# Altium project pca63571.PrjPCB
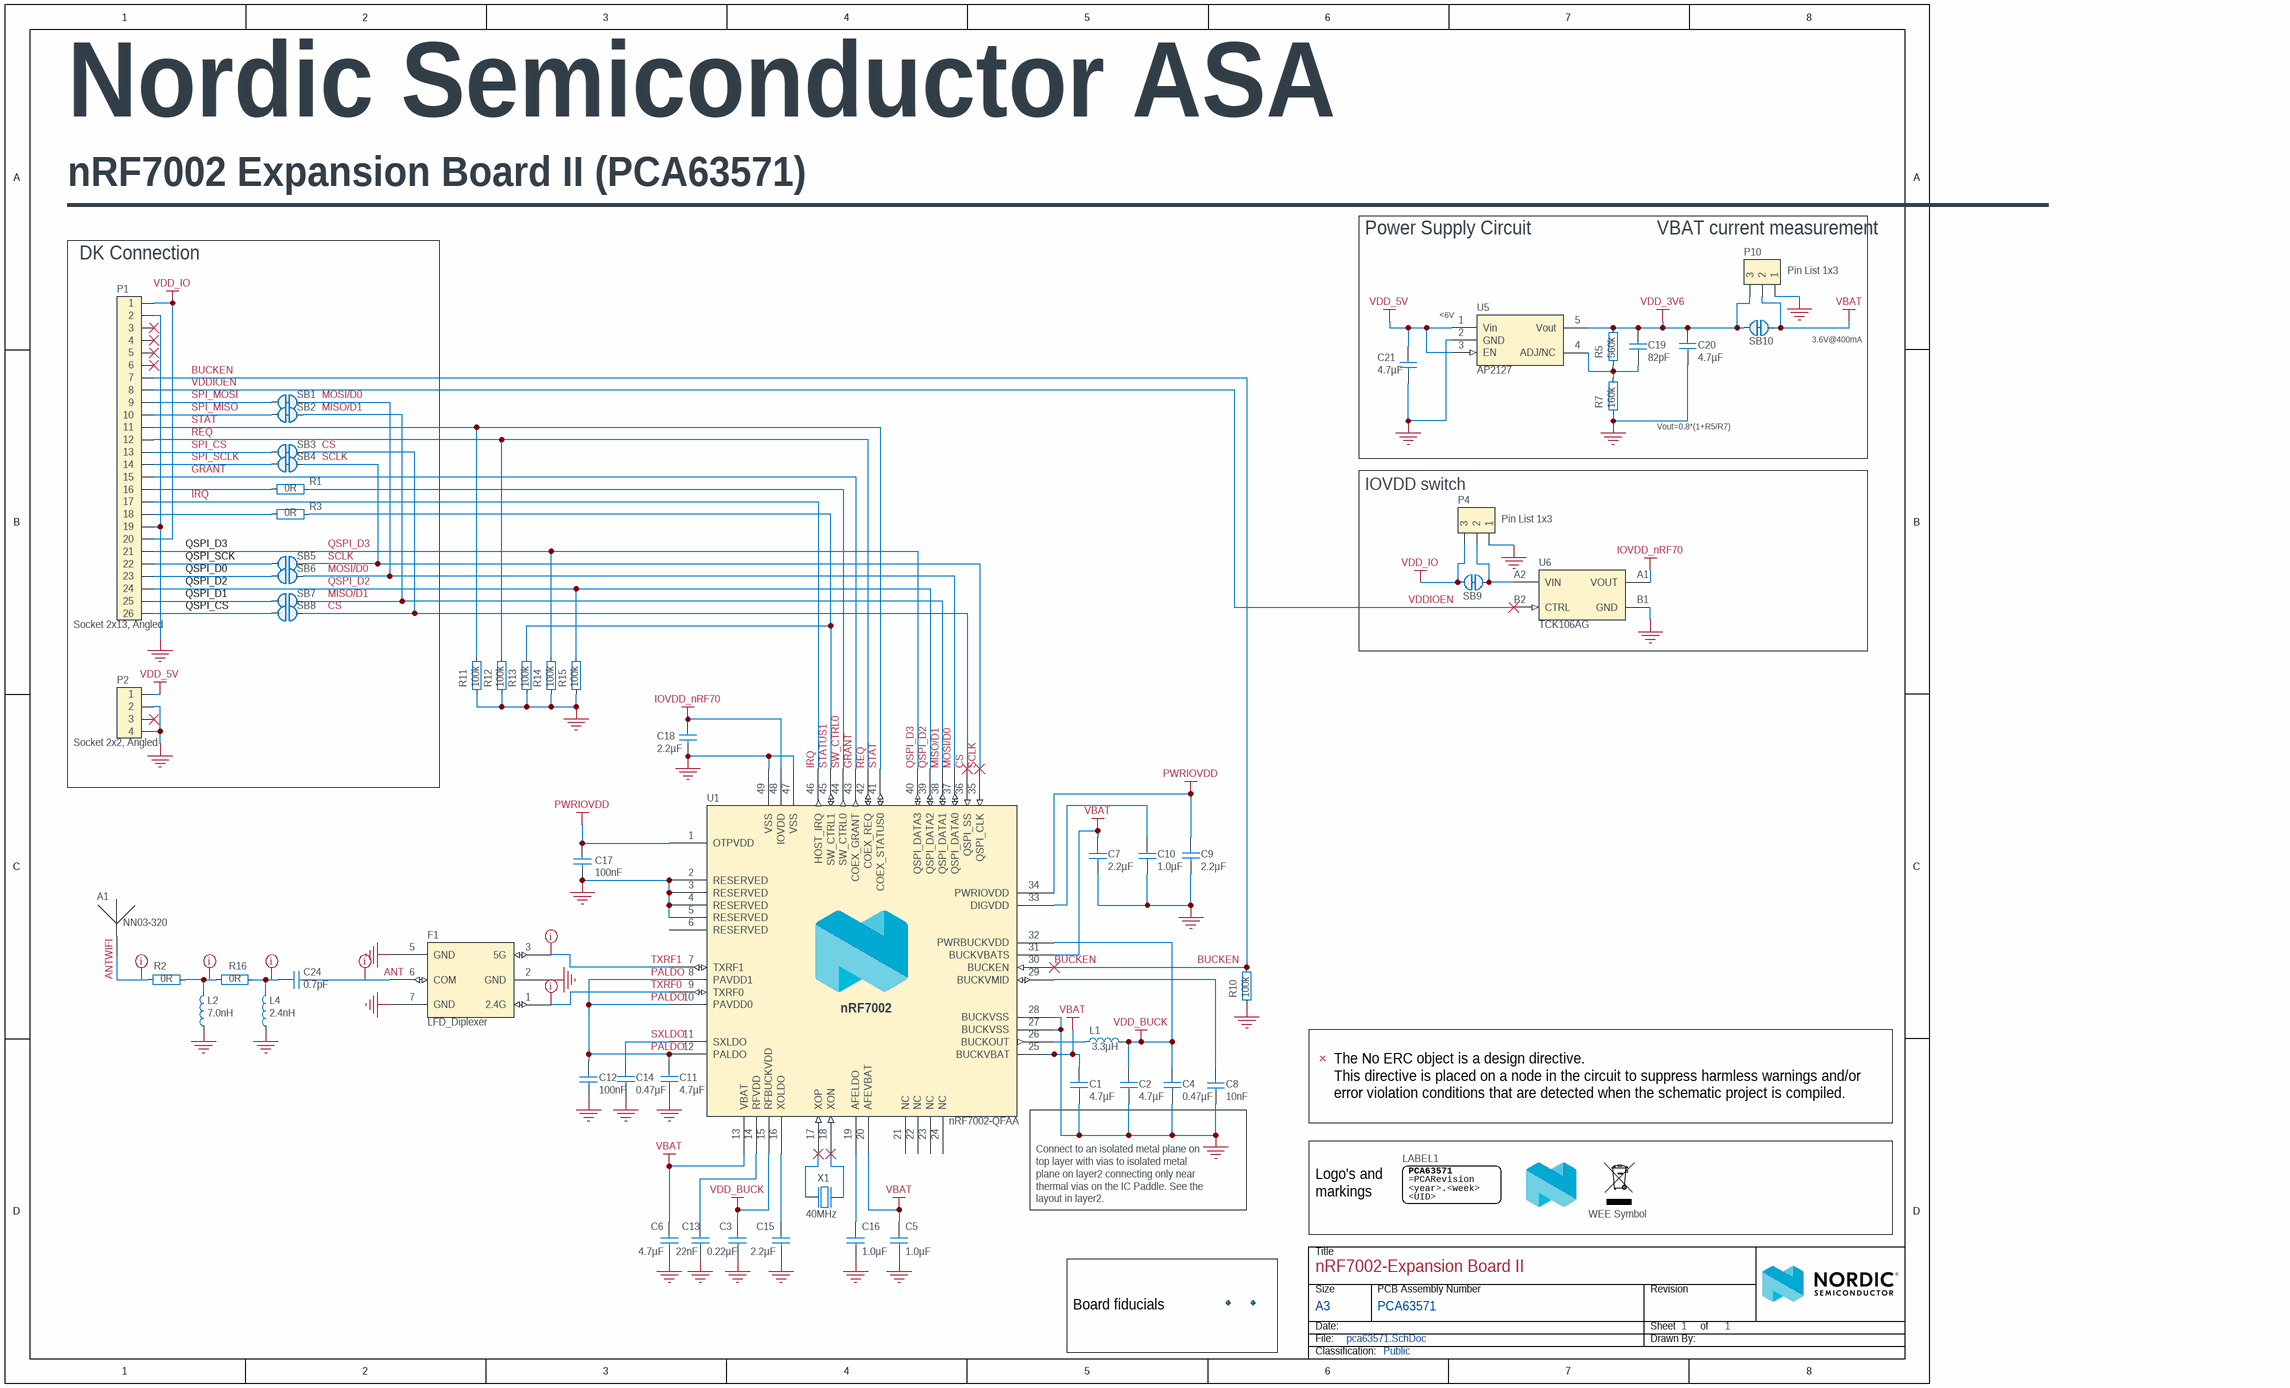
[diagram p0: pca63571.SchDoc]
SurfaceFinish: ENIG Gold; SoldermaskColor: Blue; SilkscreenColor: White; ProjectNumber: 4486; ProjectName: nRF7002 EXpansion Board II; ProductName: nRF7002-EB2; PCBStackup: 4001; PCBRevision: 0071HANY; PCBNumber: 400902; PCARevision: 1.0.0; PCAName: PCA63571; Organization: Nordic Semiconductor; NrOfLayers: 4; Dielectric: FR-4; Designer: HANY; Compliance: RoHS, REACH, Halogen-Free; Classification: Public; BoardTitle: nRF7002 Expansion Board II; BoardThickness: 1.6mm
1 sheet, 62 parts. Net scope: global (net labels, ports and power ports of the same name join across sheets).
Board files: 400902.PcbDoc, 400902_panel.PcbDoc

## Sheet pca63571.SchDoc: nRF7002-Expansion Board II
size A3; Organization: Nordic Semiconductor; Revision: 1.0.0; SheetNumber: 1; SheetTotal: 1; Author: HANY; CompanyName: Nordic Semiconductor; DrawnBy: HANY; DocumentSize: A4; ProjectName: nRF7002 EXpansion Board II

### Parts
A1  NN03-320  [NN03-320]
C1  4.7µF  [CAPC1608X06L]
C2  4.7µF  [CAPC1608X06L]
C3  0.22µF  [CAPC0603X03L_C]
C4  0.47µF  [CAPC0603X03L_C]
C5  1.0µF  [CAPC1005X04L]
C6  4.7µF  [CAPC1608X06L]
C7  2.2µF  [CAPC1608X06L]
C8  10nF  [CAPC0603X03L_C]
C9  2.2µF  [CAPC1005X04L]
C10  1.0µF  [CAPC1005X04L]
C11  4.7µF  [CAPC1608X06L]
C12  100nF  [CAPC0603X03L_C]
C13  22nF  [CAPC0603X03L_C]
C14  0.47µF  [CAPC0603X03L_C]
C15  2.2µF  [CAPC0603X03L_C]
C16  1.0µF  [CAPC1005X04L]
C17  100nF  [CAPC0603X03L_C]
C18  2.2µF  [CAPC1608X06L]
C19  82pF  [CAPC0603X03L_C]
C20  4.7µF  [CAPC1608X06L]
C21  4.7µF  [CAPC1608X06L]
C24  0.7pF  [CAPC1005X04L]
F1  LFD_Diplexer  [CAF-50P160X80-6N]
Fid1  Fiducial mark  [Fiducial]  (value not drawn)  (no BOM)
Fid2  Fiducial mark  [Fiducial]  (value not drawn)  (no BOM)
L1  3.3µH  [INDC2520X10N]
L2  7.0nH  [INDC1005X04L_WW]
L4  2.4nH  [INDC1005X04L_WW]
LABEL1  12x32mm  [LabelSilk_12x32]  (value not drawn)
LOGO1  (no value)  [NORDIC_LOGO_LYING]  (graphical)
LOGO2  WEE Symbol  [WEEE_3x4.5mm]  (no BOM)
P1  Socket 2x13, Angled  [SOCKET_ANG_2x13_SMD-2.54mm-Mirrored]
P2  Socket 2x2, Angled  [SOCKET_ANG_2x2_SMD-2.54mm-Mirrored]
P4  Pin List 1x3  [LIST_1x3]
P10  Pin List 1x3  [LIST_1x3]
R1  0R  [RESC1005X04L]
R2  0R  [RESC1005X04L]
R3  0R  [RESC1005X04L]
R5  560k  [RESC0603X03L_C]
R7  160k  [RESC0603X03L_C]
R10  100k  [RESC0603X03L_C]
R11  100k  [RESC0603X03L_C]
R12  100k  [RESC0603X03L_C]
R13  100k  [RESC0603X03L_C]
R14  100k  [RESC0603X03L_C]
R15  100k  [RESC0603X03L_C]
R16  0R  [RESC1005X04L]
SB1  Solderbridge  [Solderbridge_SHORTED_0.4]  (value not drawn)  (net tie, no BOM)
SB2  Solderbridge  [Solderbridge_SHORTED_0.4]  (value not drawn)  (net tie, no BOM)
SB3  Solderbridge  [Solderbridge_SHORTED_0.4]  (value not drawn)  (net tie, no BOM)
SB4  Solderbridge  [Solderbridge_SHORTED_0.4]  (value not drawn)  (net tie, no BOM)
SB5  Solderbridge  [Solderbridge_0.4]  (value not drawn)  (no BOM)
SB6  Solderbridge  [Solderbridge_0.4]  (value not drawn)  (no BOM)
SB7  Solderbridge  [Solderbridge_0.4]  (value not drawn)  (no BOM)
SB8  Solderbridge  [Solderbridge_0.4]  (value not drawn)  (no BOM)
SB9  Solderbridge  [Solderbridge_Shorted_Power]  (value not drawn)  (net tie, no BOM)
SB10  Solderbridge  [Solderbridge_Shorted_Power]  (value not drawn)  (net tie, no BOM)
U1  nRF7002-QFAA  [QFN40P600X600X60-48N]
U5  AP2127  [SOT95P282X145-5N]
U6  TCK106AG  [BGA4C40P2X2_76X76X62]
X1  40MHz  [BT-XTAL_1612]

### Blocks framed on the sheet
DK Connection: P1 P2 R1 R3 SB1-SB8
IOVDD switch: P4 SB9 U6

### Nets
GND: C1.1 C2.1 C3.1 C4.1 C5.1 C6.1 C7.2 C8.2 C9.1 C10.2 C11.1 C12.2 C13.1 C14.1 C15.1 C16.1 C17.1 C18.1 C20.1 C21.1 F1.2(GND) F1.5(GND) F1.7(GND) L2.1 L4.1 P1.2 P1.19 P2.2 P2.4 P4.1 P10.1 R7.1 R10.2 R11.2 R12.2 R13.1 R14.2 R15.2 U1.2(RESERVED) U1.3(RESERVED) U1.4(RESERVED) U1.5(RESERVED) U1.27(BUCKVSS) U1.28(BUCKVSS) U1.47(VSS) U1.49(VSS) U5.2(GND) U6.B1(GND) X1.2(GND) X1.4(GND)
IOVDD_nRF70: C18.2 U1.48(IOVDD) U6.A1(VOUT)
PWRIOVDD: C9.2 C17.2 U1.1(OTPVDD) U1.34(PWRIOVDD)
VBAT: C1.2 C5.2 C6.2 C7.1 P10.2 SB10.2 U1.13(VBAT) U1.20(AFEVBAT) U1.25(BUCKVBAT) U1.31(BUCKVBATS)
VDD_3V6: C19.1 C20.2 P10.3 R5.2 SB10.1 U5.5(Vout)
VDD_5V: C21.2 P2.1 U5.1(Vin) U5.3(EN)
VDD_BUCK: C2.2 C3.2 C4.2 L1.2 U1.15(RFBUCKVDD) U1.32(PWRBUCKVDD)
VDD_IO: P1.1 P1.20 P4.3 SB9.2
ANT: C24.2 F1.6(COM)
ANTWIFI: A1.4(Feed1) R2.1
BUCKEN: P1.7 R10.1 U1.30(BUCKEN)
CS: SB3.1 SB8.1 U1.36(QSPI_SS)
GRANT: P1.15 U1.43(COEX_GRANT)
IRQ: P1.17 U1.46(HOST_IRQ)
MISO/D1: SB2.1 SB7.1 U1.38(QSPI_DATA1)
MOSI/D0: SB1.1 SB6.1 U1.37(QSPI_DATA0)
PALDO: C11.2 C12.1 U1.8(PAVDD1) U1.10(PAVDD0) U1.12(PALDO)
QSPI_D2: P1.24 R15.1 U1.39(QSPI_DATA2)
QSPI_D3: P1.21 R14.1 U1.40(QSPI_DATA3)
REQ: P1.12 R12.1 U1.42(COEX_REQ)
SCLK: SB4.1 SB5.1 U1.35(QSPI_CLK)
SPI_CS: P1.13 SB3.2
SPI_MISO: P1.10 SB2.2
SPI_MOSI: P1.9 SB1.2
SPI_SCLK: P1.14 SB4.2
STAT: P1.11 R11.1 U1.41(COEX_STATUS0)
STATUS1: R3.2 R13.2 U1.45(SW_CTRL1)
SW_CTRL0: R1.2 U1.44(SW_CTRL0)
SXLDO: C14.2 U1.11(SXLDO)
TXRF0: F1.1(2.4G) U1.9(TXRF0)
TXRF1: F1.3(5G) U1.7(TXRF1)
VDDIOEN: P1.8 U6.B2(CTRL)
NetC8_1: C8.1 U1.29(BUCKVMID)
NetC10_1: C10.1 U1.33(DIGVDD)
NetC13_2: C13.2 U1.14(RFVDD)
NetC15_2: C15.2 U1.16(XOLDO)
NetC16_2: C16.2 U1.19(AFELDO)
NetC19_2: C19.2 R5.1 R7.2 U5.4(ADJ/NC)
NetC24_1: C24.1 L4.2 R16.2
NetL1_1: L1.1 U1.26(BUCKOUT)
NetL2_2: L2.2 R2.2 R16.1
NetP1_16: P1.16 R1.1
NetP1_18: P1.18 R3.1
NetP1_22: P1.22 SB5.2
NetP1_23: P1.23 SB6.2
NetP1_25: P1.25 SB7.2
NetP1_26: P1.26 SB8.2
NetP4_2: P4.2 SB9.1 U6.A2(VIN)
NetU1_17: U1.17(XOP) X1.1(inp)
NetU1_18: U1.18(XON) X1.3(out)

Not connected (* = marked no-connect by the designer): A1 1(NC) 2(GND) 3(Feed2); P1 3* 4* 5* 6*; P2 3*; U1 6(RESERVED) 21(NC) 22(NC) 23(NC) 24(NC)

### Layout directives
net class RF: ANT, ANTWIFI, NetC24_1, NetL2_2, TXRF0, TXRF1

### Notes on the sheet
- Nordic Semiconductor ASA
- nRF7002 Expansion Board II (PCA63571)
- _______________________________________________________________________
- Power Supply Circuit
- (near P10) VBAT current measurement
- (near U5) <6V
- 3.6V@400mA
- Vout=0.8*(1+R5/R7)
- QSPI_D2
- QSPI_D3
- QSPI_SCK
- QSPI_D0
- QSPI_D1
- QSPI_CS
- The No ERC object is a design directive.
  This directive is placed on a node in the circuit to suppress harmless warnings and/or error violation conditions that are detected when the schematic project is compiled.
- (near U1) Connect to an isolated metal plane on top layer with vias to isolated metal plane on layer2 connecting only near thermal vias on the IC Paddle. See the layout in layer2.
- (near LABEL1) Logo's and markings
- (near Fid1) Board fiducials
- Title
- Size
- Date:
- File:
- A3
- PCB Assembly Number
- Sheet
- Drawn By:
- Revision
- of
- Classification:
- (in symbol Label_12x32) <year>.<week>; <UID>

### Library data of the parts
A1 = NN03-320: Dual-Band GNSS and Wi-Fi/BluetoothAntenna; Manufacturer: Ignion; Part number NEMS: 100700066; Component Status: Active; Pad Count: 4; Note: N.A.; Part Number: NN03-320; Component Class: Antennas; Author: rubr; Manufacturer Part Number: NN03-320; ComponentLink1URL: https://ignion.io/files/DS_NN03-320.pdf; ComponentLink1Description: Datasheet; ComponentLink2URL: https://ignion.io/product/duo-mxtend/; ComponentLink2Description: Supplier link; HelpURL: https://ignion.io/files/UM_NN03-320.pdf; LatestRevisionDate: 2021-12-10; Published: 2023-01-31; Footprint Doc: NN03-320; Value: NN03-320; Supplier 1: DigiKey; Supplier Part Number 1: 2115-NN03-320CT-ND; Supplier 2: Mouser; Supplier Part Number 2: 128-NN03-320; Artikkelnr Noca: N.A.; Part number IPS: N.A.; Part number Norautron: N.A.; PartId: 100700066
C1 C2 C6 C11 = C0603-4µ7-25V-X6S-GRM188C81E475KE11: Capacitor, Ceramic, 4.7µF 25V X6S 0603,±10%; Manufacturer: Murata; Manufacturer Part Number: GRM188C81E475KE11D; Part number NEMS: 100200486; Pad Count: 2; Artikkelnr Noca: N.A.; Component Status: Active; Part Number: C0603-4µ7-25V-X6S-GRM188C81E475KE11; Component Class: Capacitors; Author: prbu; ComponentLink1URL: https://www.murata.com/en-global/products/productdetail?partno=GRM188C81E475KE11%23; ComponentLink1Description: Datasheet; ComponentLink2URL: https://www.digikey.com/en/products/detail/murata-electronics/GRM188C81E475KE11D/3900424; ComponentLink2Description: Supplier link; HelpURL: N.A.; Footprint Doc: 0603; LatestRevisionDate: 2021-12-09; Published: 2021-12-09; Value: 4.7µF; Note: 25V; Supplier 1: DigiKey; Supplier Part Number 1: 490-7199-1-ND; Supplier 2: Mouser; Supplier Part Number 2: 81-GRM188C81E475KE1D; Part number IPS: N.A.; Part number Norautron: N.A.; PartId: 100200486
C3 = C0201-220n-10V-X5R-GRM033R61A224KE90: Capacitor, Ceramic, 0.22µF 10V X5R 0201, ±10%; Manufacturer: Murata; Manufacturer Part Number: GRM033R61A224KE90D; Part number NEMS: 100200487; Pad Count: 2; Artikkelnr Noca: N.A.; Component Status: Active; Part Number: C0201-220n-10V-X5R-GRM033R61A224KE90; Component Class: Capacitors; Author: prbu; ComponentLink1URL: https://www.murata.com/en-sg/products/productdetail?partno=GRM033R61A224KE90%23; ComponentLink1Description: Datasheet; ComponentLink2URL: https://www.mouser.com/ProductDetail/Murata-Electronics/GRM033R61A224KE90D?qs=sGAEpiMZZMtXHE36kCvv3zgoTDayw1zTTbet6g8ub%252Bg%3D; ComponentLink2Description: Supplier link; HelpURL: N.A.; Footprint Doc: 0201; LatestRevisionDate: 2021-12-09; Published: 2021-12-09; Value: 0.22µF; Note: 10V; Supplier 1: Mouser; Supplier Part Number 1: 81-GRM33R61A224KE90D; Supplier 2: Mouser; Supplier Part Number 2: 81-GRM033R61A224KE0J; Part number IPS: N.A.; Part number Norautron: N.A.; PartId: 100200487
C4 C14 = C0201-470n-6.3V-X5R-GRM033R60J474KE90: Capacitor, Ceramic, 0.47µF 6.3V X5R 0201,±10%; Manufacturer: Murata; Manufacturer Part Number: GRM033R60J474KE90D; Part number NEMS: 100200488; Pad Count: 2; Artikkelnr Noca: N.A.; Component Status: Active; Part Number: C0201-470n-6.3V-X5R-GRM033R60J474KE90; Component Class: Capacitors; Author: prbu; ComponentLink1URL: https://www.murata.com/en-sg/products/productdetail?partno=GRM033R60J474KE90%23; ComponentLink1Description: Datasheet; ComponentLink2URL: https://www.mouser.com/ProductDetail/Murata-Electronics/GRM033R60J474KE90D?qs=sGAEpiMZZMsKMBVpGK0sItoTn08PM719efpAd7qZWQ4%3D; ComponentLink2Description: Supplier link; HelpURL: N.A.; Footprint Doc: 0201; LatestRevisionDate: 2021-12-09; Published: 2021-12-09; Value: 0.47µF; Note: 6.3V; Supplier 1: DigiKey; Supplier Part Number 1: 490-10409-1-ND; Supplier 2: Mouser; Supplier Part Number 2: 81-GRM33R60J474KE90D; Part number IPS: N.A.; Part number Norautron: N.A.; PartId: 100200488
C5 = C0402-1µ0-35V-X5R-GRM155R6YA105KE11: Capacitor, Ceramic, 1.0µF 35V X5R 0402,±10%; Manufacturer: Murata; Manufacturer Part Number: GRM155R6YA105KE11D; Part number NEMS: 100200489; Pad Count: 2; Artikkelnr Noca: N.A.; Component Status: Active; Part Number: C0402-1µ0-35V-X5R-GRM155R6YA105KE11; Component Class: Capacitors; Author: prbu; ComponentLink1URL: https://www.murata.com/en-sg/products/productdetail?partno=GRM155R6YA105KE11%23; ComponentLink1Description: Datasheet; ComponentLink2URL: https://www.digikey.com/en/products/detail/murata-electronics/GRM155R6YA105KE11D/4905162; ComponentLink2Description: Supplier link; HelpURL: N.A.; Footprint Doc: 0402; LatestRevisionDate: 2021-12-09; Published: 2021-12-09; Value: 1.0µF; Note: 35V; Supplier 1: Mouser; Supplier Part Number 1: 81-GRM155R6YA105KE1D; Supplier 2: DigiKey; Supplier Part Number 2: 490-10019-1-ND; Part number IPS: N.A.; Part number Norautron: N.A.; PartId: 100200489
C7 C18 = C0603-2µ2-16V-X7S-GRM188C71C225KE11: Capacitor, Ceramic, 2.2µF 16V X7S 0603,±10%; Manufacturer: Murata; Manufacturer Part Number: GRM188C71C225KE11D; Part number NEMS: 100200490; Pad Count: 2; Artikkelnr Noca: N.A.; Component Status: Active; Part Number: C0603-2µ2-16V-X7S-GRM188C71C225KE11; Component Class: Capacitors; Author: prbu; ComponentLink1URL: https://www.murata.com/en-sg/products/productdetail?partno=GRM188C71C225KE11%23; ComponentLink1Description: Datasheet; ComponentLink2URL: https://www.mouser.com/ProductDetail/Murata-Electronics/GRM188C71C225KE11D?qs=ipkqEa07%2FjwigLKmkO4MzA%3D%3D; ComponentLink2Description: Supplier link; HelpURL: N.A.; Footprint Doc: 0603; LatestRevisionDate: 2021-12-09; Published: 2021-12-09; Value: 2.2µF; Note: 16V; Supplier 1: Mouser; Supplier Part Number 1: 81-GRM188C71C225KE1D; Supplier 2: DigiKey; Supplier Part Number 2: 490-12731-1-ND; Part number IPS: N.A.; Part number Norautron: N.A.; PartId: 100200490
C8 = C0201-10n-16V-X7R-GRM033R71C103KE14: Capacitor, Ceramic, 10nF 16V X7R 0201,±10%; Manufacturer: Murata; Manufacturer Part Number: GRM033R71C103KE14D; Part number NEMS: 100200491; Pad Count: 2; Artikkelnr Noca: N.A.; Component Status: Active; Part Number: C0201-10n-16V-X7R-GRM033R71C103KE14; Component Class: Capacitors; Author: prbu; ComponentLink1URL: https://www.murata.com/en-sg/products/productdetail?partno=GRM033R71C103KE14%23; ComponentLink1Description: Datasheet; ComponentLink2URL: https://www.mouser.com/ProductDetail/Murata-Electronics/GRM033R71C103KE14D?qs=QzBtWTOodeUmwPFZnw4Ogg%3D%3D; ComponentLink2Description: Supplier link; HelpURL: N.A.; Footprint Doc: 0201; LatestRevisionDate: 2021-12-09; Published: 2021-12-09; Value: 10nF; Note: 16V; Supplier 1: DigiKey; Supplier Part Number 1: 490-14453-1-ND; Supplier 2: Mouser; Supplier Part Number 2: 81-GRM033R71C103KE4D; Part number IPS: N.A.; Part number Norautron: N.A.; PartId: 100200491
C9 = C0402-2µ2-25V-X5R-GRM155R61E225KE11: Capacitor, Ceramic, 2.2µF 25V X5R 0402,±10%; Manufacturer: Murata; Manufacturer Part Number: GRM155R61E225KE11D; Part number NEMS: 100200492; Pad Count: 2; Artikkelnr Noca: N.A.; Component Status: Active; Part Number: C0402-2µ2-25V-X5R-GRM155R61E225KE11; Component Class: Capacitors; Author: prbu; ComponentLink1URL: https://www.murata.com/en-sg/products/productdetail?partno=GRM155R61E225KE11%23; ComponentLink1Description: Datasheet; ComponentLink2URL: https://www.mouser.com/ProductDetail/Murata-Electronics/GRM155R61E225KE11D?qs=eeBpzGFlv%252B8X58bIUndZvA%3D%3D; ComponentLink2Description: Supplier link; HelpURL: N.A.; Footprint Doc: 0402; LatestRevisionDate: 2021-12-09; Published: 2021-12-09; Value: 2.2µF; Note: 25V; Supplier 1: Mouser; Supplier Part Number 1: 81-GRM155R61E225KE1D; Supplier 2: DigiKey; Supplier Part Number 2: 490-12703-1-ND; Part number IPS: N.A.; Part number Norautron: N.A.; PartId: 100200492
C10 = C0402-1µ0-16V-X6S-GRM155C81C105KE11D: Capacitor, Ceramic, 1.0µF 16V X6S 0402,±10%; Manufacturer: Murata; Part number NEMS: 100200516; Pad Count: 2; Artikkelnr Noca: N.A.; Component Status: Active; Part Number: C0402-1µ0-16V-X6S-GRM155C81C105KE11D; Component Class: Capacitors; Author: prbu; Manufacturer Part Number: GRM155C81C105KE11D; ComponentLink1URL: https://www.murata.com/en-sg/products/productdetail?partno=GRM155C81C105KE11%23; ComponentLink1Description: Datasheet; ComponentLink2URL: https://www.digikey.com/en/products/detail/murata-electronics/GRM155C81C105KE11D/4905091; ComponentLink2Description: Supplier link; HelpURL: N.A.; Footprint Doc: 0402; LatestRevisionDate: 2023-01-03; Published: 2022-07-01; Value: 1.0µF; Note: 16V; Supplier 1: DigiKey; Supplier Part Number 1: 490-12700-2-ND; Supplier 2: Mouser; Supplier Part Number 2: 81-GRM155C81C105KE1D; Part number IPS: N.A.; Part number Norautron: N.A.; PartId: 100200516
C12 C17 = C0201-100n-16V-X7S-GRM033C71C104KE14: Capacitor, Ceramic, 100nF 16V X7S 0201,±10%; Manufacturer: Murata; Manufacturer Part Number: GRM033C71C104KE14D; Part number NEMS: 100200494; Pad Count: 2; Artikkelnr Noca: N.A.; Component Status: Active; Part Number: C0201-100n-16V-X7S-GRM033C71C104KE14; Component Class: Capacitors; Author: prbu; ComponentLink1URL: https://www.murata.com/en-sg/products/productdetail?partno=GRM033C71C104KE14%23; ComponentLink1Description: Datasheet; ComponentLink2URL: https://www.mouser.com/ProductDetail/Murata-Electronics/GRM033C71C104KE14D?qs=P%2FC4Eoq9CDzkjc0H6wJP9A%3D%3D; ComponentLink2Description: Supplier link; HelpURL: N.A.; Footprint Doc: 0201; LatestRevisionDate: 2021-12-09; Published: 2021-12-09; Value: 100nF; Note: 16V; Supplier 1: Mouser; Supplier Part Number 1: 81-GRM33C71C104KE14D; Supplier 2: DigiKey; Supplier Part Number 2: 490-10387-1-ND; Part number IPS: N.A.; Part number Norautron: N.A.; PartId: 100200494
C13 = C0201-22n-10V-X5R-GRM033R61A223KE84: Capacitor, Ceramic, 22nF 10V X5R 0201,±10%; Manufacturer: Murata; Manufacturer Part Number: GRM033R61A223KE84D; Part number NEMS: 100200495; Pad Count: 2; Artikkelnr Noca: N.A.; Component Status: Active; Part Number: C0201-22n-10V-X5R-GRM033R61A223KE84; Component Class: Capacitors; Author: prbu; ComponentLink1URL: https://www.murata.com/en-sg/products/productdetail?partno=GRM033R61A223KE84%23; ComponentLink1Description: Datasheet; ComponentLink2URL: https://www.mouser.com/ProductDetail/Murata-Electronics/GRM033R61A223KE84E?qs=BZBei1rCqCCPqziwOnRusw%3D%3D; ComponentLink2Description: Supplier link; HelpURL: N.A.; Footprint Doc: 0201; LatestRevisionDate: 2021-12-09; Published: 2021-12-09; Value: 22nF; Note: 10V; Supplier 1: Mouser; Supplier Part Number 1: 81-GRM033R61A223KE4E; Supplier 2: DigiKey; Supplier Part Number 2: 490-13334-1-ND; Part number IPS: N.A.; Part number Norautron: N.A.; PartId: 100200495
C15 = C0201-2µ2-10V-X5R-GRM033R61A225KE47: Capacitor, Ceramic, 2.2µF 10V X5R 0201,±10%; Manufacturer: Murata; Manufacturer Part Number: GRM033R61A225KE47D; Part number NEMS: 100200496; Pad Count: 2; Artikkelnr Noca: N.A.; Component Status: Active; Part Number: C0201-2µ2-10V-X5R-GRM033R61A225KE47; Component Class: Capacitors; Author: prbu; ComponentLink1URL: https://www.murata.com/en-sg/products/productdetail?partno=GRM033R61A225KE47%23; ComponentLink1Description: Datasheet; ComponentLink2URL: https://www.mouser.com/ProductDetail/Murata-Electronics/GRM033R61A225KE47D?qs=I53XXhTNm8tqgHaFsI1bug%3D%3D; ComponentLink2Description: Supplier link; HelpURL: N.A.; Footprint Doc: 0201; LatestRevisionDate: 2021-12-09; Published: 2021-12-09; Value: 2.2µF; Note: 10V; Supplier 1: Mouser; Supplier Part Number 1: 81-GRM033R61A225KE7D; Supplier 2: DigiKey; Supplier Part Number 2: 490-13227-1-ND; Part number IPS: N.A.; Part number Norautron: N.A.; PartId: 100200496
C16 = C0402-1µ0-10V-X7S-GRM155C71A105KE11: Capacitor, Ceramic, 1.0µF 10V X7S 0402,±10%; Manufacturer: Murata; Manufacturer Part Number: GRM155C71A105KE11D; Part number NEMS: 100200497; Pad Count: 2; Artikkelnr Noca: N.A.; Component Status: Active; Part Number: C0402-1µ0-10V-X7S-GRM155C71A105KE11; Component Class: Capacitors; Author: prbu; ComponentLink1URL: https://www.murata.com/en-sg/products/productdetail?partno=GRM155C71A105KE11%23; ComponentLink1Description: Datasheet; ComponentLink2URL: https://www.digikey.com/en/products/detail/murata-electronics/GRM155C71A105KE11D/6606086; ComponentLink2Description: Supplier link; HelpURL: N.A.; Footprint Doc: 0402; LatestRevisionDate: 2021-12-09; Published: 2021-12-09; Value: 1.0µF; Note: 10V; Supplier 1: Mouser; Supplier Part Number 1: 81-GRM155C71A105KE1J; Supplier 2: DigiKey; Supplier Part Number 2: 490-14457-1-ND; Part number IPS: N.A.; Part number Norautron: N.A.; PartId: 100200497
C19 = C0201-82p: Chip Cap 0201; Manufacturer: N.A.; Part number NEMS: 100200043; Pad Count: 2; Note: Chip Cap 1%; Component Status: Active; Part Number: C0201-82p; Component Class: Capacitors; Author: rsk; Manufacturer Part Number: N.A.; ComponentLink1URL: N.A.; ComponentLink1Description: Datasheet; ComponentLink2URL: N.A.; ComponentLink2Description: Supplier link; HelpURL: N.A.; Footprint Doc: 0201; LatestRevisionDate: 2014-11-13; Published: 2014-11-13; Value: 82pF; Supplier 1: N.A.; Supplier Part Number 1: N.A.; Supplier 2: N.A.; Supplier Part Number 2: N.A.; Artikkelnr Noca: N.A.; Part number IPS: N.A.; Part number Norautron: N.A.; PartId: 100200043
C20 C21 = C0603-4.7µ-10V-X7R: Capacitor, MLCC; Manufacturer: Murata; Manufacturer Part Number: GRM188Z71A475KE15J; Part number NEMS: 100200438; Pad Count: 2; Note: 10V; Artikkelnr Noca: N.A.; Component Status: Active; Part Number: C0603-4.7µ-10V-X7R; PartId: 100200438; Component Class: Capacitors; Author: rsk; ComponentLink1URL: https://search.murata.co.jp/Ceramy/image/img/A01X/G101/ENG/GRM188Z71A475KE15-01A.pdf; ComponentLink1Description: Datasheet; ComponentLink2URL: https://psearch.en.murata.com/capacitor/product/GRM188Z71A475KE15%23.html; ComponentLink2Description: Supplier link; HelpURL: https://no.mouser.com/ProductDetail/Murata-Electronics/GRM188Z71A475KE15J?qs=%2Fha2pyFaduhv%2F%252BvqdTaCX6sbHo9W1tclfmo%252Bk8bHlE54zWsbeQAlbA%3D%3D; Footprint Doc: 0603; LatestRevisionDate: 2020-10-13; Published: 2020-01-21; Value: 4.7µF; Supplier 1: Mouser; Supplier Part Number 1: 81-GRM188Z71A475KE5J; Supplier 2: N.A.; Supplier Part Number 2: N.A.; Part number IPS: N.A.; Part number Norautron: N.A.
C24 = C0402-0.7p-50V-C0G-GJM1555C1HR70WB01: Capacitor, C0G/NP0, 50V, ±0.05pF, 0402; Manufacturer: Murata; Manufacturer Part Number: GJM1555C1HR70WB01D; Part number NEMS: 100200707; Component Status: Active; Pad Count: 2; Artikkelnr Noca: N.A.; Part Number: C0402-0.7p-50V-C0G-GJM1555C1HR70WB01; PartId: 100200707; Component Class: Capacitors; Author: hany; ComponentLink1URL: https://search.murata.co.jp/Ceramy/image/img/A01X/G101/ENG/GJM1555C1HR70WB01-01.pdf; ComponentLink1Description: Datasheet; ComponentLink2URL: https://www.digikey.no/en/products/detail/murata-electronics/GJM1555C1HR70WB01D/2330145; ComponentLink2Description: Supplier link; HelpURL: https://pim.murata.com/en-global/pim/details/?productCategoryId=ceramicCapacitorSMD&partNum=GJM1555C1HR70WB01%23; LatestRevisionDate: 2025-09-22; Published: 2025-09-22; Footprint Doc: 0402; Value: 0.7pF; Note: 50V; Supplier 1: DigiKey; Supplier Part Number 1: 490-11252-1-ND; Supplier 2: N.A.; Supplier Part Number 2: N.A.; Part number IPS: N.A.; Part number Norautron: N.A.
F1 = LFD182G45DCJD247: Signal Conditioning 2.4GHz and 5GHz Diplexer; Manufacturer: Murata; Part number NEMS: 100800026; Pad Count: 6; Note: N.A.; Component Status: Active; Part Number: LFD182G45DCJD247; Component Class: Filters; Author: hany; Manufacturer Part Number: LFD182G45DCJD247; ComponentLink1URL: https://no.mouser.com/datasheet/2/281/1/LFD182G45DCJD247-2399435.pdf; ComponentLink1Description: Datasheet; ComponentLink2URL: N.A.; ComponentLink2Description: Supplier link; HelpURL: N.A.; Footprint Doc: CAF; LatestRevisionDate: 2021-10-06; Published: 2021-10-06; Value: LFD182G45DCJD247; Supplier 1: Mouser; Supplier Part Number 1: 81-LFD182G45DCJD247; Supplier 2: N.A.; Supplier Part Number 2: N.A.; Artikkelnr Noca: N.A.; Part number IPS: N.A.; Part number Norautron: N.A.; PartId: 100800026
Fid1 Fid2 = Fid-Mark: Manufacturer: N.A.; Part number NEMS: 100500073; Value: N.A.; Pad Count: 1; Component Status: Active; System: Connector; Part Number: Fid-Mark; Manufacturer Part Number: N.A.; LatestRevisionDate: 2009-12-12; Published: 2009-12-12; Note: N.A.; Artikkelnr Noca: N.A.; Footprint Doc: Fiducial; PartId: 100500073; Component Class: Connectors; Author: rsk; ComponentLink1URL: N.A.; ComponentLink1Description: Datasheet; ComponentLink2URL: N.A.; ComponentLink2Description: Supplier link; HelpURL: N.A.; Supplier 1: N.A.; Supplier Part Number 1: N.A.; Supplier 2: N.A.; Supplier Part Number 2: N.A.; Part number IPS: N.A.; Part number Norautron: N.A.
L1 = L1008-3µ3-LQM2HPN3R3MGCL: Inductor, 1A, ±20%, 200mOhm; Manufacturer: Murata; Part number NEMS: 100300406; Pad Count: 2; Note: -55°C ~ 125°C; Artikkelnr Noca: N.A.; Component Status: Active; Part Number: L1008-3µ3-LQM2HPN3R3MGCL; Component Class: Inductors; Author: prbu; Manufacturer Part Number: LQM2HPN3R3MGCL; ComponentLink1URL: https://www.murata.com/en-sg/products/productdetail?partno=LQM2HPN3R3MGC%23; ComponentLink1Description: Datasheet; ComponentLink2URL: https://www.digikey.com/en/products/detail/murata-electronics/LQM2HPN3R3MGCL/4359129?s=N4IgTCBcDaIDIEUCyYASAFAcgZgEraQHEBhOEAXQF8g; ComponentLink2Description: Supplier link; HelpURL: https://www.murata.com/en-sg/products/productdetail?partno=LQM2HPN3R3MGC%23; Footprint Doc: 1008; LatestRevisionDate: 2022-01-20; Published: 2022-01-20; Value: 3.3µH; Supplier 1: DigiKey; Supplier Part Number 1: 490-12070-1-ND; Supplier 2: N.A.; Supplier Part Number 2: N.A.; Part number IPS: N.A.; Part number Norautron: N.A.; PartId: 100300406
L2 = L0402-7n0-Wirewound-Murata: Inductor, 570mA, ±2%, 130mΩ; Manufacturer: Murata; Manufacturer Part Number: LQW15AN7N0G00; Part number NEMS: 100300337; Component Status: Active; Pad Count: 2; Note: -55°C ~ 125°C; Artikkelnr Noca: N.A.; Part Number: L0402-7n0-Wirewound-Murata; Component Class: Inductors; Author: rsk; ComponentLink1URL: https://search.murata.co.jp/Ceramy/image/img/P02/JELF243A-0050.pdf; ComponentLink1Description: Datasheet; ComponentLink2URL: N.A.; ComponentLink2Description: Supplier link; HelpURL: https://psearch.en.murata.com/inductor/product/LQW15AN7N0G00%23.html; LatestRevisionDate: 2019-04-16; Published: 2019-04-16; Footprint Doc: 0402; Value: 7.0nH; Supplier 1: N.A.; Supplier Part Number 1: N.A.; Supplier 2: N.A.; Supplier Part Number 2: N.A.; Part number IPS: N.A.; Part number Norautron: N.A.; PartId: 100300337
L4 = L0402-2n4-Wirewound-LQW15AN_80: Inductor, 2.53A, 2%, 22mΩ, Q=30; Manufacturer: Murata; Manufacturer Part Number: LQW15AN2N4G80; Part number NEMS: 100300507; Component Status: Active; Pad Count: 2; Note: -55°C ~ 125°C; Artikkelnr Noca: N.A.; Part Number: L0402-2n4-Wirewound-LQW15AN_80; Component Class: Inductors; Author: prbu; ComponentLink1URL: https://search.murata.co.jp/Ceramy/image/img/P02/JELF243A-0100.pdf; ComponentLink1Description: Datasheet; ComponentLink2URL: N.A.; ComponentLink2Description: Supplier link; HelpURL: https://www.murata.com/en-sg/products/productdetail?partno=LQW15AN2N4G80%23; LatestRevisionDate: 2024-12-31; Published: 2024-12-31; Footprint Doc: 0402; Value: 2.4nH; Supplier 1: Mouser; Supplier Part Number 1: 81-LQW15AN2N4G80D; Supplier 2: DigiKey; Supplier Part Number 2: 490-LQW15AN2N4G80DCT-ND; Part number IPS: N.A.; Part number Norautron: N.A.; PartId: 100300507
LABEL1 = Label_12x32: PCA version label, stick-on, 12x32mm; Manufacturer: Ellco Etikett; Manufacturer Part Number: 68616; Part number NEMS: 101200029; Component Status: Active; Pad Count: 0; Note: N.A.; Part Number: Label_12x32; PartId: 101200029; Component Class: Mechanicals; Author: hany; ComponentLink1URL: N.A.; ComponentLink1Description: Datasheet; ComponentLink2URL: N.A.; ComponentLink2Description: Supplier link; HelpURL: N.A.; LatestRevisionDate: 2023-01-05; Published: 2023-01-05; Footprint Doc: Label; Value: 12x32mm; Supplier 1: N.A.; Supplier Part Number 1: N.A.; Supplier 2: N.A.; Supplier Part Number 2: N.A.; Artikkelnr Noca: N.A.; Part number IPS: N.A.; Part number Norautron: N.A.
LOGO1 = Nordic Logo lying: Manufacturer: N.A.; Part number NEMS: 101100001; Component Status: Active; Pad Count: 0; Part Number: Nordic Logo lying; PartId: 101100001; Component Class: Markings; Author: rsk; Manufacturer Part Number: N.A.; ComponentLink1URL: N.A.; ComponentLink1Description: Datasheet; ComponentLink2URL: N.A.; ComponentLink2Description: Supplier link; HelpURL: N.A.; LatestRevisionDate: 2017-03-20; Published: 2017-09-01; Footprint Doc: Nordic Logo; Value: Nordic Logo; Note: N.A.; Supplier 1: N.A.; Supplier Part Number 1: N.A.; Supplier 2: N.A.; Supplier Part Number 2: N.A.; Artikkelnr Noca: N.A.; Part number IPS: N.A.; Part number Norautron: N.A.
LOGO2 = WEEE Symbol 3x4.5mm: WEEE Directive symbol; Manufacturer: N.A.; Part number NEMS: 101100006; Component Status: Active; Pad Count: 0; Part Number: WEEE Symbol 3x4.5mm; PartId: 101100006; Component Class: Markings; Author: rsk; Manufacturer Part Number: N.A.; ComponentLink1URL: N.A.; ComponentLink1Description: Datasheet; ComponentLink2URL: N.A.; ComponentLink2Description: Supplier link; HelpURL: N.A.; LatestRevisionDate: 2023-03-07; Published: 2016-09-07; Footprint Doc: WEEE_3x4.5mm; Value: WEE Symbol; Note: N.A.; Supplier 1: N.A.; Supplier Part Number 1: N.A.; Supplier 2: N.A.; Supplier Part Number 2: N.A.; Artikkelnr Noca: N.A.; Part number IPS: N.A.; Part number Norautron: N.A.
P1 = 2185-213ZG0CYNR3: Socket 2x13, 2.54mm (100mil), Right Angle, SMD; Manufacturer: WCON; Part number NEMS: 100500914; Component Status: Active; Pad Count: 26; Note: N.A.; System: Connector; Part Number: 2185-213ZG0CYNR3; Component Class: Connectors; Author: hany; Manufacturer Part Number: 2185-213ZG0CYNR3; ComponentLink1URL: https://www.wcon.com/assets/upload/2023-09-16/C_2185-2XXZXXCYNT1.pdf; ComponentLink1Description: Datasheet; ComponentLink2URL: N.A.; ComponentLink2Description: Supplier link; HelpURL: https://www.wcon.com/product/2185-2xxzxxcynx1.html; LatestRevisionDate: 2025-08-11; Published: 2025-08-11; Footprint Doc: SOCKET_ANG_2x13_SMD-2.54mm; Value: Socket 2x13, Angled; Supplier 1: N.A.; Supplier Part Number 1: N.A.; Supplier 2: N.A.; Supplier Part Number 2: N.A.; Artikkelnr Noca: N.A.; Part number IPS: N.A.; Part number Norautron: N.A.; PartId: 100500914
P2 = 2185-202ZS0CYNR3: Socket 2x2, 2.54mm (100mil), Right Angle, SMD; Manufacturer: WCON; Part number NEMS: 100500857; Component Status: Active; Pad Count: 4; Note: N.A.; System: Connector; Part Number: 2185-202ZS0CYNR3; PartId: 100500857; Component Class: Connectors; Author: daba; Manufacturer Part Number: 2185-202ZS0CYNR3; ComponentLink1URL: https://www.wcon.com/assets/upload/2023-09-16/C_2185-2XXZXXCYNT1.pdf; ComponentLink1Description: Datasheet; ComponentLink2URL: N.A.; ComponentLink2Description: Supplier link; HelpURL: https://www.wcon.com/product/2185-2xxzxxcynx1.html; LatestRevisionDate: 2024-09-27; Published: 2024-05-30; Footprint Doc: WCON_2185-202ZSxCYNRX; Value: Socket 2x2, Angled; Supplier 1: N.A.; Supplier Part Number 1: N.A.; Supplier 2: WCON; Supplier Part Number 2: 2185-202ZS0CYNR3; Artikkelnr Noca: N.A.; Part number IPS: N.A.; Part number Norautron: N.A.
P4 P10 = Pin List 1x3: Pin List 1x3, 2.54mm (100mil); Manufacturer: N.A.; Part number NEMS: 100500304; Component Status: Active; Pad Count: 3; Artikkelnr Noca: 56019041; System: Connector; Part Number: Pin List 1x3; PartId: 100500304; Component Class: Connectors; Author: rsk; Manufacturer Part Number: N.A.; ComponentLink1URL: N.A.; ComponentLink1Description: Datasheet; ComponentLink2URL: N.A.; ComponentLink2Description: Supplier link; HelpURL: N.A.; LatestRevisionDate: 2009-12-12; Published: 2009-12-12; Footprint Doc: LIST_1x3; Value: Pin List 1x3; Note: N.A.; Supplier 1: N.A.; Supplier Part Number 1: N.A.; Supplier 2: N.A.; Supplier Part Number 2: N.A.; Part number IPS: N.A.; Part number Norautron: N.A.
R1-R3 R16 = R0402-0R: Resistor, ±5%, 0.063W; Manufacturer: N.A.; Part number IPS: 00000007128; Part number NEMS: 100100109; Component Status: Active; Pad Count: 2; Note: Chip Res 5%; Artikkelnr Noca: 27049000; Part Number: R0402-0R; Component Class: Resistors; Author: rsk; Manufacturer Part Number: N.A.; ComponentLink1URL: N.A.; ComponentLink1Description: Datasheet; ComponentLink2URL: N.A.; ComponentLink2Description: Supplier link; HelpURL: N.A.; LatestRevisionDate: 2009-11-23; Published: 2009-05-08; Footprint Doc: 0402; Value: 0R; Supplier 1: Farnell; Supplier Part Number 1: 146-9661; Supplier 2: N.A.; Supplier Part Number 2: N.A.; Part number Norautron: N.A.; PartId: 100100109
R5 = R0201-560k: Resistor, ±1%, 0.05W; Manufacturer: N.A.; Part number IPS: 00000004799; Part number NEMS: 100100090; Note: Chip Res 1%; Pad Count: 2; Component Status: Active; Part Number: R0201-560k; Manufacturer Part Number: N.A.; ComponentLink1URL: N.A.; ComponentLink1Description: Datasheet; ComponentLink2URL: N.A.; ComponentLink2Description: Supplier link; HelpURL: N.A.; Footprint Doc: 0201; LatestRevisionDate: 2014-11-13; Published: 2014-11-13; Value: 560k; Artikkelnr Noca: N.A.; Supplier 1: N.A.; Supplier Part Number 1: N.A.; Supplier 2: N.A.; Supplier Part Number 2: N.A.; Component Class: Resistors; PartId: 100100090; Author: rsk; Part number Norautron: N.A.
R7 = R0201-160k: Resistor, ±1%, 0.05W; Manufacturer: N.A.; Part number NEMS: 100100657; Note: Chip Res 1%; Pad Count: 2; Component Status: Active; Part Number: R0201-160k; Manufacturer Part Number: N.A.; ComponentLink1URL: N.A.; ComponentLink1Description: Datasheet; ComponentLink2URL: N.A.; ComponentLink2Description: Supplier link; HelpURL: N.A.; Footprint Doc: 0201; LatestRevisionDate: 2022-03-28; Published: 2022-03-28; Value: 160k; Artikkelnr Noca: N.A.; Part number IPS: N.A.; Supplier 1: N.A.; Supplier Part Number 1: N.A.; Supplier 2: N.A.; Supplier Part Number 2: N.A.; Component Class: Resistors; Author: hany; Part number Norautron: N.A.; PartId: 100100657
R10-R15 = R0201-100k: Resistor, ±1%, 0.05W; Manufacturer: N.A.; Part number IPS: 00000001419; Part number Norautron: 26108487; Part number NEMS: 100100080; Note: Chip Res 1%; Pad Count: 2; Component Status: Active; Part Number: R0201-100k; Manufacturer Part Number: N.A.; ComponentLink1URL: N.A.; ComponentLink1Description: Datasheet; ComponentLink2URL: N.A.; ComponentLink2Description: Supplier link; HelpURL: N.A.; Footprint Doc: 0201; LatestRevisionDate: 2014-11-13; Published: 2014-11-13; Value: 100k; Artikkelnr Noca: N.A.; Supplier 1: N.A.; Supplier Part Number 1: N.A.; Supplier 2: N.A.; Supplier Part Number 2: N.A.; Component Class: Resistors; PartId: 100100080; Author: rsk
SB1-SB4 = Solderbridge Shorted 0.4mm: Shorted Solderbridge; Manufacturer: N.A.; Part number NEMS: 100500561; Component Status: Active; Pad Count: 2; System: Connector; Part Number: Solderbridge Shorted 0.4mm; PartId: 100500561; Component Class: Connectors; Author: rsk; Manufacturer Part Number: N.A.; ComponentLink1URL: N.A.; ComponentLink1Description: Datasheet; ComponentLink2URL: N.A.; ComponentLink2Description: Supplier link; HelpURL: N.A.; LatestRevisionDate: 2012-08-07; Published: 2012-08-07; Footprint Doc: Solderbridge_Shorted; Value: Solderbridge; Note: N.A.; Supplier 1: N.A.; Supplier Part Number 1: N.A.; Supplier 2: N.A.; Supplier Part Number 2: N.A.; Artikkelnr Noca: N.A.; Part number IPS: N.A.; Part number Norautron: N.A.
SB5-SB8 = Solderbridge 0.4mm: Manufacturer: N.A.; Part number NEMS: 100500560; Component Status: Active; Pad Count: 2; System: Connector; Part Number: Solderbridge 0.4mm; PartId: 100500560; Component Class: Connectors; Author: rsk; Manufacturer Part Number: N.A.; ComponentLink1URL: N.A.; ComponentLink1Description: Datasheet; ComponentLink2URL: N.A.; ComponentLink2Description: Supplier link; HelpURL: N.A.; LatestRevisionDate: 2009-12-14; Published: 2009-12-14; Footprint Doc: Solderbridge; Value: Solderbridge; Note: N.A.; Supplier 1: N.A.; Supplier Part Number 1: N.A.; Supplier 2: N.A.; Supplier Part Number 2: N.A.; Artikkelnr Noca: N.A.; Part number IPS: N.A.; Part number Norautron: N.A.
SB9 SB10 = Solderbridge Shorted Power: Shorted Solderbridge Power; Manufacturer: N.A.; Part number NEMS: 100500460; Pad Count: 2; Component Status: Active; System: Connector; Part Number: Solderbridge Shorted Power; PartId: 100500460; Component Class: Connectors; Author: rsk; Manufacturer Part Number: N.A.; ComponentLink1URL: N.A.; ComponentLink1Description: Datasheet; ComponentLink2URL: N.A.; ComponentLink2Description: Supplier link; HelpURL: N.A.; Footprint Doc: Solderbridge_Shorted_Power; LatestRevisionDate: 2012-08-07; Published: 2012-08-07; Value: Solderbridge; Note: N.A.; Supplier 1: N.A.; Supplier Part Number 1: N.A.; Supplier 2: N.A.; Supplier Part Number 2: N.A.; Artikkelnr Noca: N.A.; Part number IPS: N.A.; Part number Norautron: N.A.
U1 = nRF7002-QFAAB0: Wi-fi Dual Band Companion chip; Manufacturer: Nordic Semiconductor; Part number NEMS: 102000276; Pad Count: 49; Note: N.A.; Component Status: Active; Part Number: nRF7002-QFAAB0; Component Class: Nordic_Devices; Author: hany; Manufacturer Part Number: nRF7002-QFAAB0; ComponentLink1URL: N.A.; ComponentLink1Description: Datasheet; ComponentLink2URL: N.A.; ComponentLink2Description: Supplier link; HelpURL: N.A.; Footprint Doc: QFN-48; LatestRevisionDate: 2023-01-11; Published: 2023-01-11; Value: nRF7002-QFAA; Supplier 1: Nordic Semiconductor; Supplier Part Number 1: nRF7002-QFAAB0; Supplier 2: N.A.; Supplier Part Number 2: N.A.; Artikkelnr Noca: N.A.; Part number IPS: N.A.; Part number Norautron: N.A.; PartId: 102000276
U5 = AP2127K-ADJTRG1: IC REG LDO ADJ 0.3A SOT23-5; Manufacturer: Diodes Incorporated; Part number NEMS: 101900493; Pad Count: 5; Note: N.A.; Component Status: Active; Part Number: AP2127K-ADJTRG1; PartId: 101900493; Component Class: Misc_ICs; Author: rsk; Manufacturer Part Number: AP2127K-ADJTRG1; ComponentLink1URL: N.A.; ComponentLink1Description: Datasheet; ComponentLink2URL: N.A.; ComponentLink2Description: Supplier link; HelpURL: https://www.diodes.com/assets/Datasheets/AP2127.pdf; Footprint Doc: SOT23-5; LatestRevisionDate: 2017-07-20; Published: 2017-07-20; Value: AP2127; Supplier 1: DigiKey; Supplier Part Number 1: AP2127K-ADJTRG1DITR-ND; Supplier 2: N.A.; Supplier Part Number 2: N.A.; Artikkelnr Noca: N.A.; Part number IPS: N.A.; Part number Norautron: N.A.
U6 = TCK106AG: 1.0 A Load Switch IC with Slew Rate Control Driver in Ultra Small Package; Manufacturer: Toshiba; Manufacturer Part Number: TCK106AG,LF; Part number IPS: 00000004390; Part number Norautron: 26500627; Part number NEMS: 101900575; Note: N.A.; Pad Count: 4; Component Status: Active; Part Number: TCK106AG; ComponentLink1URL: https://toshiba.semicon-storage.com/info/docget.jsp?did=30131&prodName=TCK106AG; ComponentLink1Description: Datasheet; ComponentLink2URL: N.A.; ComponentLink2Description: Supplier link; HelpURL: N.A.; Footprint Doc: WLCSP-4; LatestRevisionDate: 2019-03-01; Published: 2019-02-17; Value: TCK106AG; Supplier 1: DigiKey; Supplier Part Number 1: TCK106AGLFTR-ND; Supplier 2: Mouser; Supplier Part Number 2: 757-TCK106AGLF; Artikkelnr Noca: N.A.; Component Class: Misc_ICs; PartId: 101900575; Author: rsk
X1 = XTAL_SMD1612_40MHz_8pF_Kyocera: XTAL SMD 1612, 40MHz, Cl=8pF, Total Tol: ±10ppm, -30 - 85C; Manufacturer Part Number: CX1612DB40000D0WLLCC; Part number NEMS: 101600104; Component Status: Active; Pad Count: 4; Note: XTAL SMD 40.000MHz 8pF; Artikkelnr Noca: N.A.; Part Number: XTAL_SMD1612_40MHz_8pF_Kyocera; Component Class: Oscillators; Author: hany; Manufacturer: Kyocera; ComponentLink1URL: N.A.; ComponentLink1Description: Datasheet; ComponentLink2URL: N.A.; ComponentLink2Description: Supplier link; HelpURL: N.A.; LatestRevisionDate: 2023-02-03; Published: 2023-02-03; Footprint Doc: XTAL_1612; Value: 40MHz; Supplier 1: N.A.; Supplier Part Number 1: N.A.; Supplier 2: N.A.; Supplier Part Number 2: N.A.; Part number IPS: N.A.; Part number Norautron: N.A.; PartId: 101600104

## Assembly variants
Default: not fitted P4 P10 R1 R3